# EAGLE design Grove - Air quality sensor v1.3 (EAGLE 6.4)

## Sheet 1 of 3
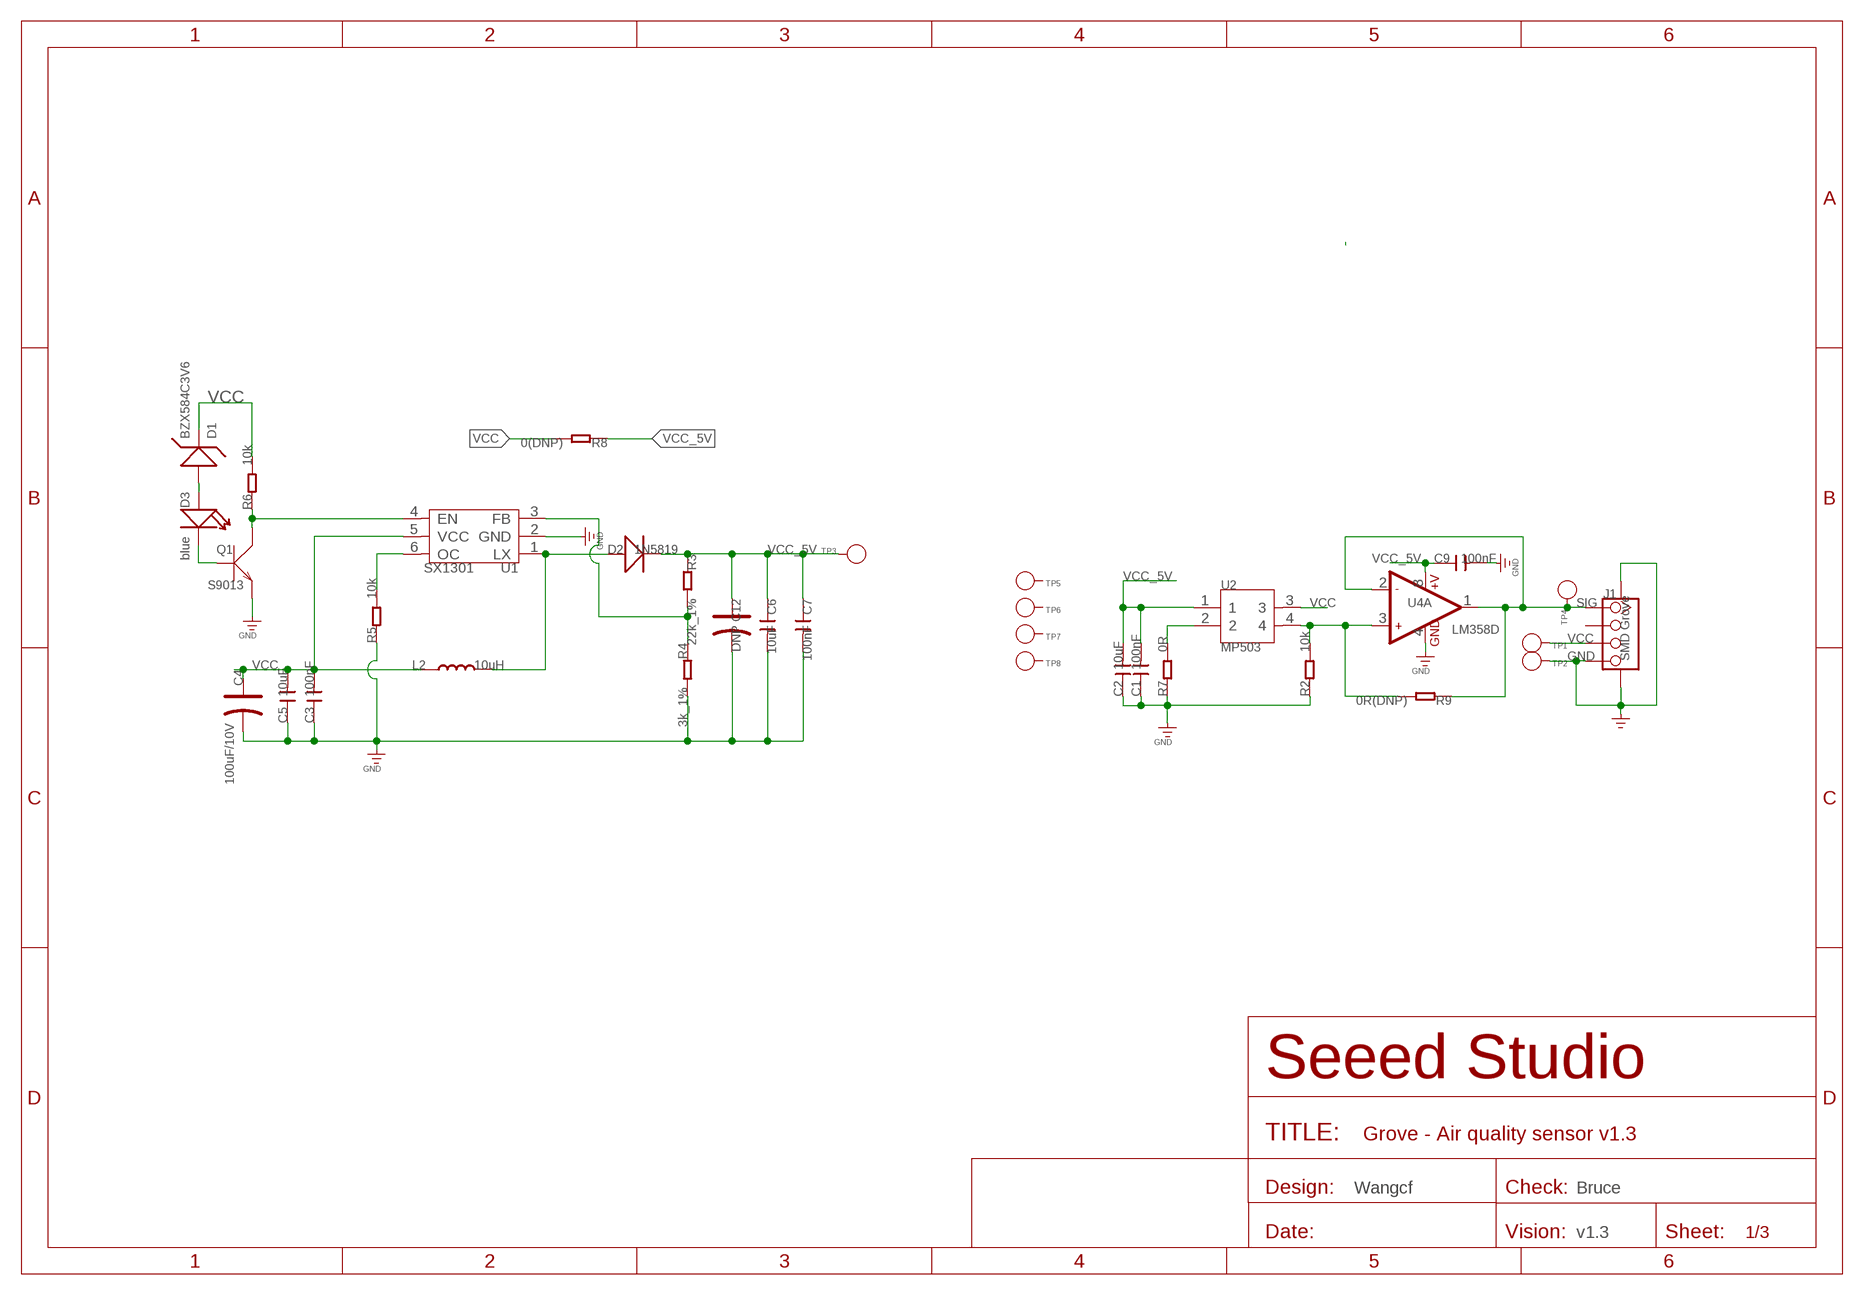
[diagram p0: schematic, sheet 1]

### Parts
C1  100nF  C-0603  [C0603]
C2  10uF  C-0805  [C0805]
C3  100nF  C-0603  [C0603]
C4  100uF/10V  CAP-AVX-B  [AVX-B]
C5  10uF  C-0805  [C0805]
C6  10uF  C-0805  [C0805]
C7  100nF  C-0603  [C0603]
C9  100nF  C-0603  [C0603]
C12  DNP  CAP-AVX-B  [AVX-B]
D1  BZX584C3V6  D-ZENER-2P'BZX584CX'  [SOD-523]
D2  1N5819  D'SMA'  [DO-214AC]
D3  blue  LED'0603'  [LED-0603]
J1  SMD Grove  TWIG-4P-2.0-SMD-FEMALE-REINFORCE'DD'  [4P-SMD-2.0]
L2  10uH  CD32'4R7'  [SD32-4R7MC]
Q1  S9013  TRANSISTOR-NPN-SOT23  [SOT-23]
R2  10k  R-0603  [R0603]
R3  22k_1%  R-0603  [R0603]
R4  3k_1%  R-0603  [R0603]
R5  10k  R-0603  [R0603]
R6  10k  R-0603  [R0603]
R7  0R  R-0603  [R0603]
R8  0(DNP)  R-0603  [R0603]
R9  0R(DNP)  R-0603  [R0603]
TP1  PAD-TEST-POINT'4545'  [TP_4545]
TP2  PAD-TEST-POINT'4545'  [TP_4545]
TP3  PAD-TEST-POINT'4545'  [TP_4545]
TP4  PAD-TEST-POINT'4545'  [TP_4545]
TP5  PAD-TEST-POINT'4545'  [TP_4545]
TP6  PAD-TEST-POINT'4545'  [TP_4545]
TP7  PAD-TEST-POINT'4545'  [TP_4545]
TP8  PAD-TEST-POINT'4545'  [TP_4545]
U1  SX1301  [SOT23-6L]
U2  MP503  SENSOR-MP503'V1.3'  [4P_3.1_9.4*9.4*17MM]
U4  LM358D  LMV358D  [SO08]

### Nets
EN: Q1.3(C) R6.1 U1.4(EN)
GND: C1.1 C2.1 C3.1 C4.- C5.1 C6.2 C7.2 C9.2 C12.- J1.4 J1.SS1 J1.SS2 Q1.2(E) R2.1 R4.2 R5.1 R7.1 TP2.T U1.2(GND) U4.4(A:GND)
N$1: R5.2 U1.6(OC)
N$2: D1.+ D3.+
N$3: D2.1(+) L2.2 U1.1(LX)
N$4: D3.- Q1.1(B)
N$5: R7.2 U2.2
N$6: R3.2 R4.1 U1.3(FB)
N$11: R2.2 R9.2 U2.4 U4.3(A:+IN1)
SIG: J1.1 R9.1 TP4.T U4.1(A:OUT1) U4.2(A:-IN1)
VCC: C3.2 C4.+ C5.2 D1.- J1.3 L2.1 R6.2 R8.2 TP1.T U1.5(VCC) U2.3
VCC_5V: C1.2 C2.2 C6.1 C7.1 C9.1 C12.+ D2.2(-) R3.1 R8.1 TP3.T U2.1 U4.8(A:+V)
Unconnected: J1.2 TP5.T TP6.T TP7.T TP8.T U4.5(B:+IN2) U4.6(B:-IN2) U4.7(B:OUT2)

### Notes on the sheet
- Wangcf | Bruce
- v1.3

## Sheet 2 of 3

## Sheet 3 of 3
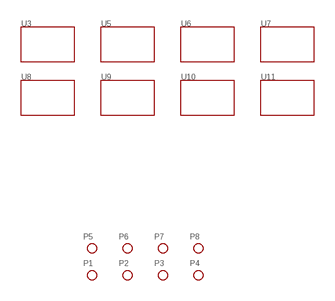
[diagram p1: schematic, sheet 3]

### Parts
P1  PAD-MARK  [ROUND-MARK-1.0]
P2  PAD-MARK  [ROUND-MARK-1.0]
P3  PAD-MARK  [ROUND-MARK-1.0]
P4  PAD-MARK  [ROUND-MARK-1.0]
P5  PAD-MARK  [ROUND-MARK-1.0]
P6  PAD-MARK  [ROUND-MARK-1.0]
P7  PAD-MARK  [ROUND-MARK-1.0]
P8  PAD-MARK  [ROUND-MARK-1.0]
U3  TWIG'2U'  [GROVE-TEST-PLATFORM]
U5  TWIG'2U'  [GROVE-TEST-PLATFORM]
U6  TWIG'2U'  [GROVE-TEST-PLATFORM]
U7  TWIG'2U'  [GROVE-TEST-PLATFORM]
U8  TWIG'2U'  [GROVE-TEST-PLATFORM]
U9  TWIG'2U'  [GROVE-TEST-PLATFORM]
U10  TWIG'2U'  [GROVE-TEST-PLATFORM]
U11  TWIG'2U'  [GROVE-TEST-PLATFORM]

## Library data of the parts
C1-C3 C5-C7 C9 = Discrete:C*: Ceramic Capacitors
C4 C12 = Discrete:CAP*: Electrolytic Capacitors,Tantalum Capacitors and Super Capacitors
D1 = Discrete-new:D-ZENER-2P: SOD-123:304030008;SOT-23:304030000
D2 = Discrete:D*
D3 = Discrete-new:LED
J1 = Connector :TWIG-4P-2.0-SMD-FEMALE-REINFORCE
L2 = template3:CD32: ferrite cored coil
P1-P8 = Discrete:PAD-MARK; PARTNO: DNP
Q1 = Discrete-new:TRANSISTOR-NPN*: NPN audion
R2-R9 = Discrete:R*
TP1-TP8 = Discrete:PAD-TEST-POINT; PARTNO: DNP
U1 = study:SX1301
U2 = template3:SENSOR-MP503: Air Purity Sensor
U3 U5-U11 = template:TWIG
U4 = IC:LMV358: General purpose LOW Voltage, Rail-to-Rail Output Amplifiers http://www.fairchildsemi.com/ds/LM/LMV358.pdf

## Board
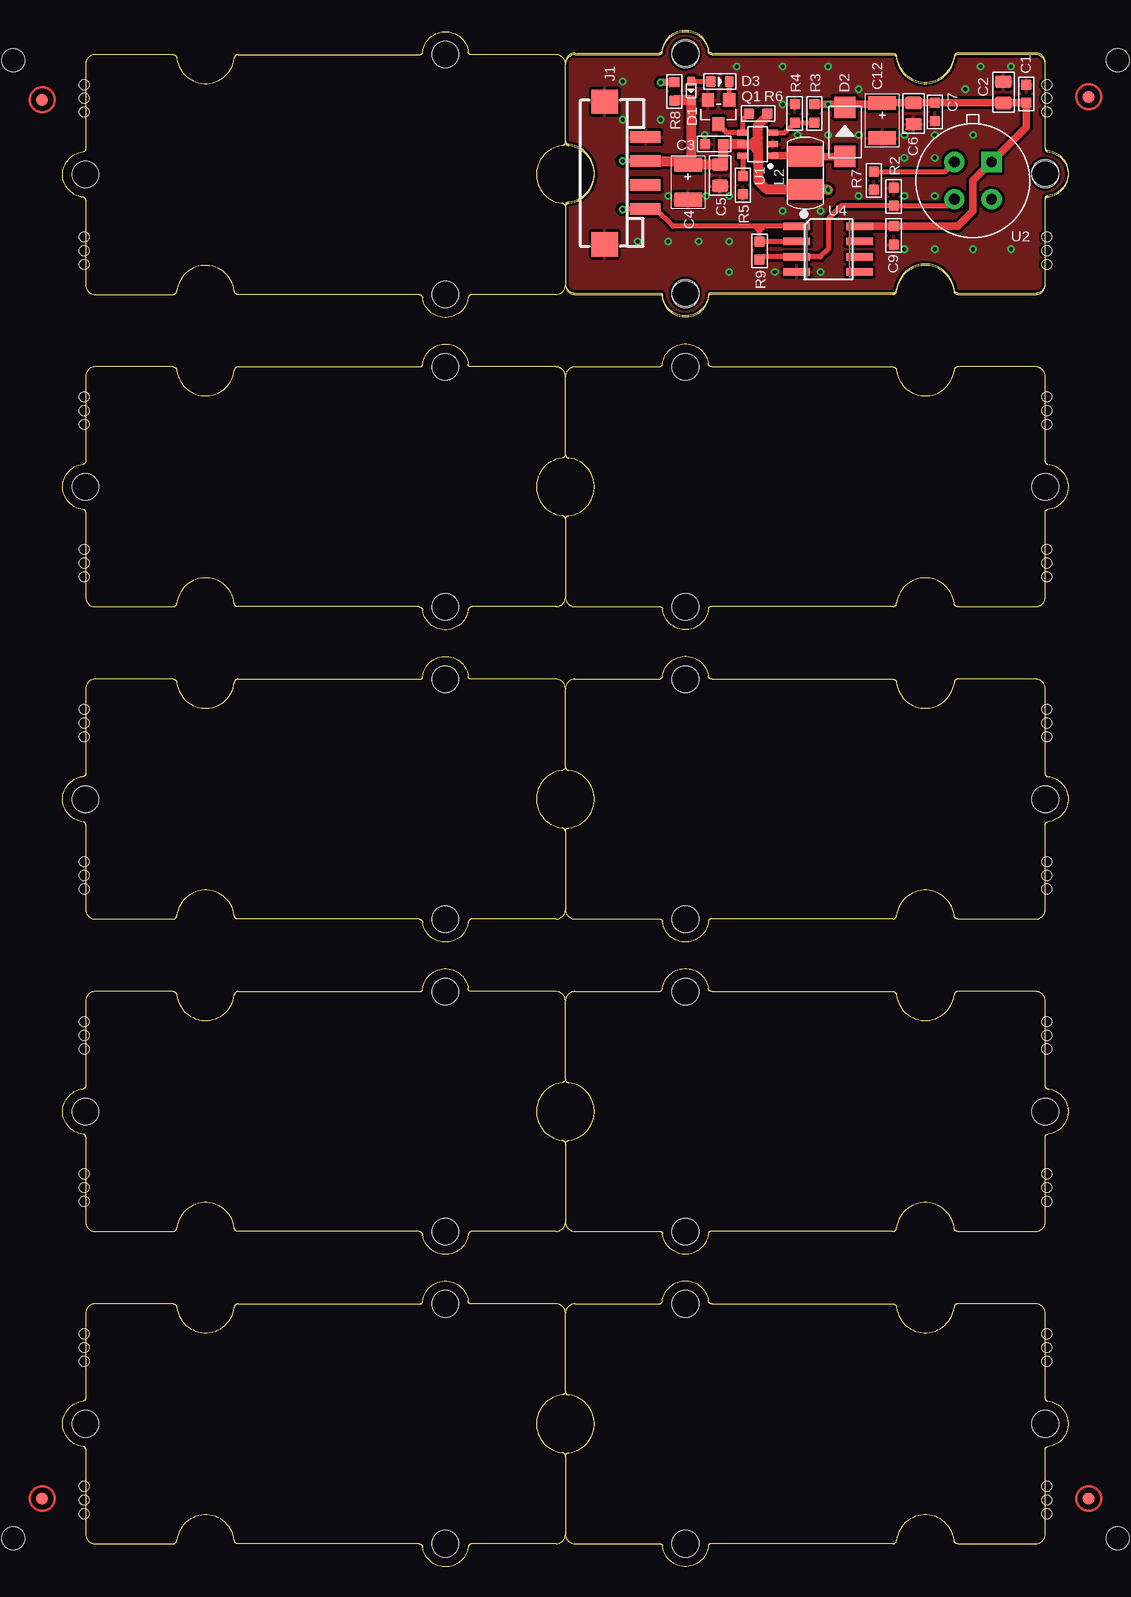
[diagram p2: board, top side]
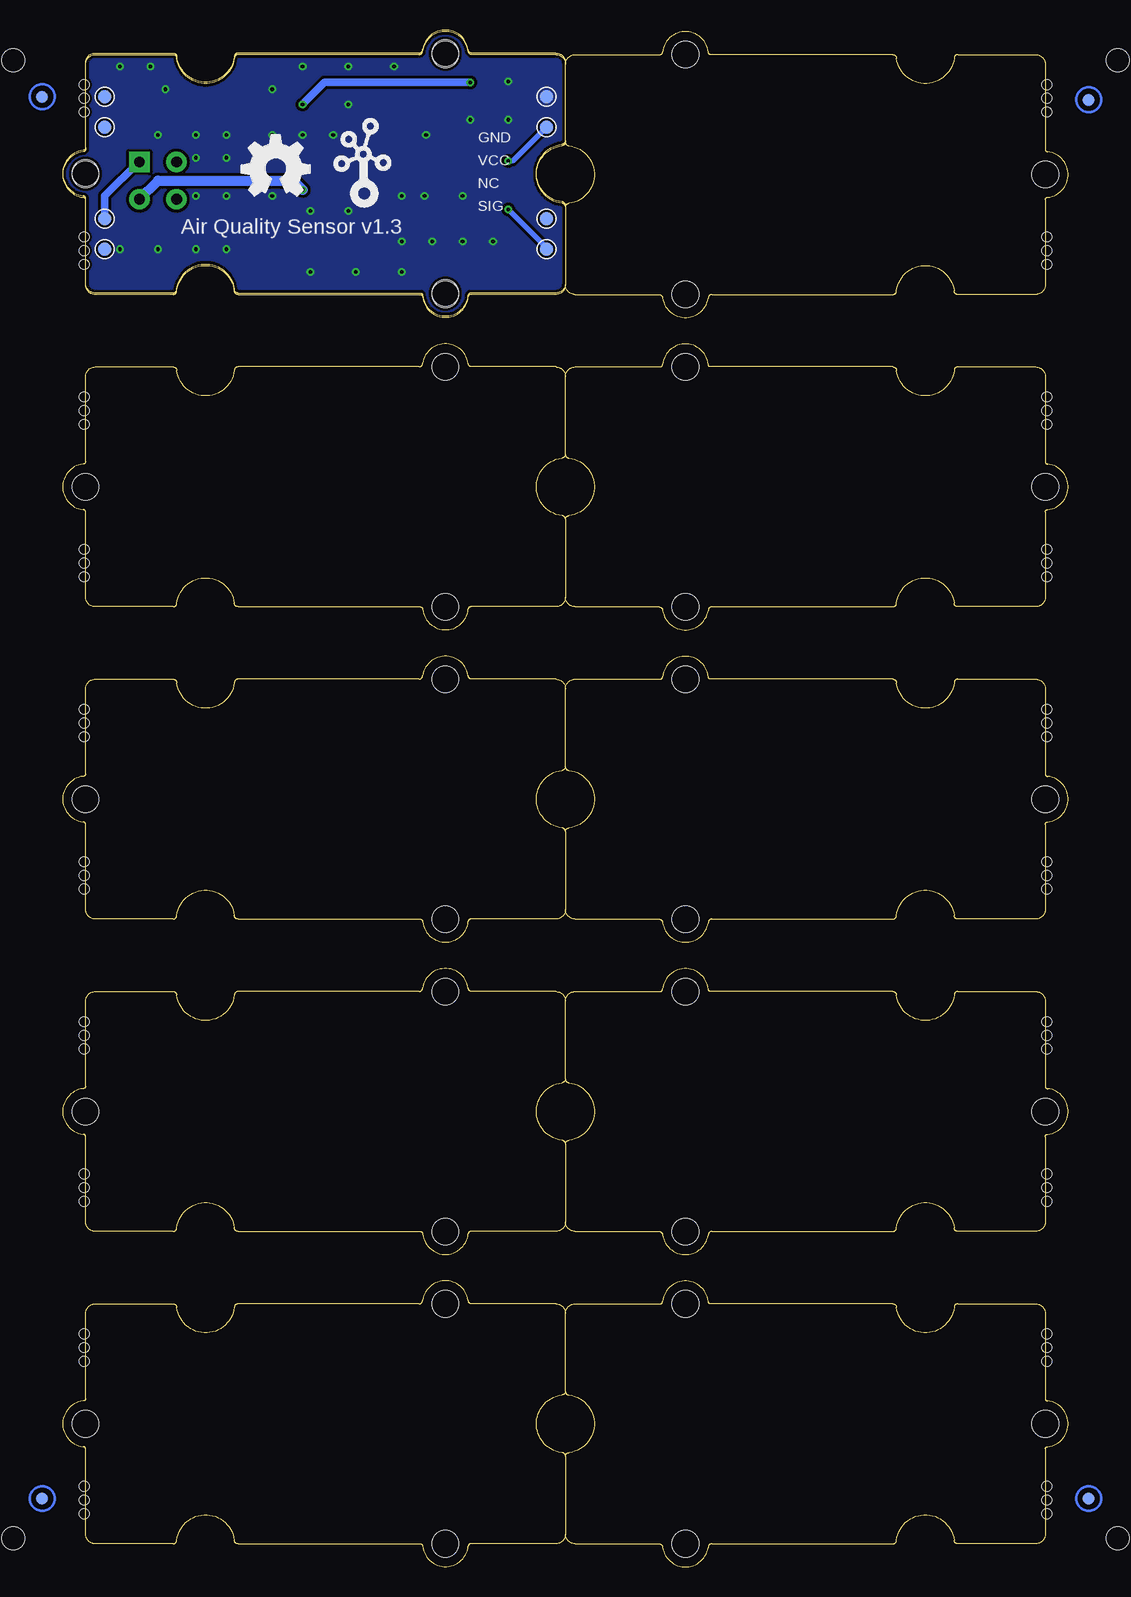
[diagram p3: board, bottom side, seen from below]

Size 83.82 x 128.11 mm. Coordinates in mm from the lower left corner, seen from the top.
Copper layers (1*16): Top 0.035mm / dielectric 1.5mm / Bottom 0.035mm
Design rules "SeeedStudio_2layer_DRU_no_angle_20140221 *": minimum track width 6mil, minimum drill 12mil, track to track 6mil, track to pad 6mil, pad to pad 6mil, via to via 6mil, smd to smd 0mil, copper to edge 10mil, drill to drill 10mil, minimum pad ring 10mil, minimum via ring 6mil, stop-mask expansion 2mil, vias tented up to drill 100mil, thermal gap 10mil
Holes 0.8 mm at 1.78,123.55 1.78,121.27 1.78,122.41 1.78,110.85 1.78,108.57 1.78,109.71 1.78,97.52 1.78,95.23 1.78,96.38 1.78,84.82 1.78,82.53 1.78,83.68 1.78,71.48 1.78,69.2 1.78,70.34 1.78,58.78 1.78,56.5 1.78,57.64 1.78,45.45 1.78,43.16 1.78,44.31 1.78,32.75 1.78,30.46 1.78,31.61 1.78,19.41 1.78,17.13 1.78,18.27 1.78,6.71 1.78,4.43 1.78,5.57 82.04,121.27 82.04,123.55 82.04,122.41 82.04,108.57 82.04,110.85 82.04,109.71 82.04,95.23 82.04,97.52 82.04,96.38 82.04,82.53 82.04,84.82 82.04,83.68 82.04,69.2 82.04,71.48 82.04,70.34 82.04,56.5 82.04,58.78 82.04,57.64 82.04,43.16 82.04,45.45 82.04,44.31 82.04,30.46 82.04,32.75 82.04,31.61 82.04,17.13 82.04,19.41 82.04,18.27 82.04,4.43 82.04,6.71 82.04,5.57
Holes 1.91 mm at -4.13,2.4 87.95,2.4 87.95,125.59 -4.13,125.59
tRestrict: area 58.7,115.9 to 63.4,116.4

### Footprints (pad centres in the part's own frame; a part is rotated, then mirrored left to right if it is on the bottom)
C0603 = smd 0.889 x 0.889: 1 -0.762,0; 2 0.762,0
C0805 = smd 1.016 x 1.397: 1 -0.889,0; 2 0.889,0
AVX-B = smd 1.143 x 2.286: + -1.46,0; - 1.46,0
SOD-523 = smd 0.762 x 0.7: + -0.8,0; - 0.8,0
DO-214AC = smd 1.8 x 1.77: 1 -2.042,0; 2 2.042,0
LED-0603 = smd 0.762 x 0.889: + -0.762,0; - 0.762,0
4P-SMD-2.0 = smd 0.965 x 2.54: 1 -3,0; 2 -1,0; 3 1,0; 4 3,0 | smd 2.032 x 2.184: SS1 -5.946,3.4; SS2 5.946,3.4
SD32-4R7MC = smd 1.75 x 3: 1 -1.375,0; 2 1.375,0
ROUND-MARK-1.0 = smd 1.016 x 1.016: P$1 0,0
SOT-23 = smd 1.016 x 1.143: 1 -0.889,-1.016; 2 0.889,-1.016; 3 0,1.016
R0603 = smd 0.889 x 0.889: 1 -0.762,0; 2 0.762,0
TP_4545 = smd 1.143 x 1.143: T 0,0
SOT23-6L = smd 0.5 x 0.9: 1 -0.961,-1.212; 2 -0.011,-1.212; 3 0.94,-1.212; 4 0.94,1.288; 5 -0.011,1.288; 6 -0.961,1.288
4P_3.1_9.4*9.4*17MM = drill 0.9 pad 1.7 square: 1 -1.55,-1.55 | drill 0.9 pad 1.7: 2 1.55,-1.55; 3 -1.55,1.55; 4 1.55,1.55
GROVE-TEST-PLATFORM = hole 2.2: -10,-10; -10,10; 20,0
SO08 = smd 0.61 x 2.21: 1 -1.905,-2.616; 2 -0.635,-2.616; 3 0.635,-2.616; 4 1.905,-2.616; 5 1.905,2.616; 6 0.635,2.616; 7 -0.635,2.616; 8 -1.905,2.616

### Placement (x,y rotation side)
C1  80.33,122.79 270 top
C2  78.42,122.92 270 top
C3  54.29,118.6 0 top
C4  52.13,115.43 270 top
C5  54.8,116 90 top
C6  70.93,121.14 270 top
C7  72.71,121.27 270 top
C9  69.28,110.98 270 top
C12  68.33,120.57 270 top
D1  52.39,123.05 270 top
D2  65.22,119.62 90 top
D3  54.8,123.81 0 top
J1  48.58,116.19 90 top
L2  61.91,116.19 90 top
P1  -1.71,5.7 0 top
P2  85.54,5.7 0 top
P3  -1.71,122.28 0 top
P4  85.54,122.54 0 top
P5  -1.71,5.7 0 bottom
P6  85.54,5.7 0 bottom
P7  85.54,122.54 0 bottom
P8  -1.71,122.28 0 bottom
Q1  54.67,121.27 180 top
R2  69.28,114.22 270 top
R3  62.68,121.14 270 top
R4  61.02,121.14 90 top
R5  56.71,115.17 90 top
R6  57.98,121.14 0 top
R7  67.63,115.55 90 top
R8  50.99,122.98 270 top
R9  58.1,109.71 270 top
TP1  43.5,120 0 bottom
TP2  43.5,122.54 0 bottom
TP3  80.33,112.38 0 bottom
TP4  43.5,109.84 0 bottom
TP5  80.33,109.84 0 bottom
TP6  80.33,120 0 bottom
TP7  43.5,112.38 0 bottom
TP8  80.33,122.54 0 bottom
U1  57.98,118.6 90 top
U2  75.88,115.55 180 top
U3  61.91,37.96 0 top
U4  63.82,109.84 270 top
U5  21.91,37.96 180 top
U6  61.91,63.99 0 top
U7  21.91,63.99 180 top
U8  61.91,90.03 0 top
U9  21.91,90.03 180 top
U10  21.91,116.06 180 top
U11  61.91,116.06 0 top
U12  [GROVE-TEST-PLATFORM]  61.91,11.92 0 top
U13  [GROVE-TEST-PLATFORM]  21.91,11.92 180 top
U$6  [GROVE-TEST-PLATFORM]  61.91,116.19 0 top
U$7  [OSHW_FILLX200_NOTEXT]  68.9,114.28 0 bottom
U$8  [TWIGLOGO]  58.74,114.28 0 bottom

### Tracks (layer width: path | path; a pad name or v marks a point on that pad's centre or on a via)
EN
  Top 0.406: R6.1 56.69,120.62 U1.4 55.39,119.54 Q1.3
GND  (via drill 0.3 pad 0.64)
  other vias: 60.01,125.08 75.25,123.17 72.71,119.36 75.88,119.36 70.17,119.36 72.71,114.28 66.36,114.28 70.17,109.84 63.18,107.93 59.37,107.93 55.56,107.93 55.56,110.47 53.02,110.47 50.48,110.47 47.94,110.47 50.48,114.28 53.66,114.28 55.56,114.28 53.53,119.36 60.01,121.9 49.85,120.63 46.67,120.63 46.67,123.81 70.17,117.46 72.71,117.46 70.17,114.28 72.71,109.84 79.06,109.84 75.88,109.84 66.36,119.36 61.28,119.36 60.01,113.01 63.82,119.36 63.18,113.01 66.36,123.17 63.82,125.08 56.2,125.08 79.06,125.08 76.52,125.08
  pour Top (isolate 0.254): 41.59,128.25 84.14,128.25 84.14,104.12 41.59,104.12
  pour Bottom (isolate 0.254): 41.59,128.25 84.14,128.25 84.14,104.12 41.59,104.12
N$1
  Top 0.406: U1.6 56.69,115.95 R5.2
N$2
  Top 0.406: 52.43,123.81 D1.+ 52.39,123.81 D3.+
N$3
  Top 0.61: U1.1 61.84,117.64 L2.2 65.2,117.56 D2.1
N$4
  Top 0.406: Q1.1 D3.-
N$5
  Top 0.406: R7.2 73.55,116.32 U2.2
N$6
  Top 0.406: U1.3 60.19,119.54 R4.1 R3.2
N$11
  Top 0.406: R9.2 58.36,109.2 U4.3 63.18,109.2 63.82,109.84 63.82,112.38 64.9,113.46 R2.2 73.79,113.46 U2.4
SIG  (via drill 0.3 pad 0.64)
  Top 0.406: v46.67,113.14 46.72,113.19 J1.1 48.66,113.27 49.34,113.27 50.86,111.74 57.72,111.74 | U4.1 58.48,111.74 | 58.48,111.74 58.1,111.74 | 58.1,111.74 57.72,111.74 | U4.2 R9.1 58.1,111.36 | 58.1,111.36 58.1,111.74 | 57.72,111.74 58.1,111.36 | 58.1,111.36 58.48,111.74
  Bottom 0.406: TP4.T 43.5,109.97 v46.67,113.14
VCC  (via drill 0.3 pad 0.64)
  Top 0.406: J1.3 46.69,117.19 v46.67,117.2
  Top 0.813: 57.46,118.59 U1.5 55.07,118.59 C3.2 55.06,116.95 54.87,116.95 C5.2 52.64,116.89 | 57.48,118.59 57.97,118.59 57.98,118.6 | 57.98,118.09 57.98,115.55 58.72,114.81 L2.1 61.94,114.79 v63.82,114.79 | 57.98,118.6 57.98,119.11 | 57.98,119.11 57.98,120.19 58.74,120.95 R6.2 | 57.46,118.59 57.98,119.11 | 57.46,118.59 57.48,118.59 | 57.48,118.59 57.98,118.09 | 57.98,118.09 57.98,118.6 | 52.64,116.89 52.39,116.89 | 52.39,116.89 C4.+ 52.39,117.14 | J1.3 52.53,117.19 52.64,117.08 52.64,116.89 | 52.39,116.89 D1.- 51.02,122.25 R8.2
  Bottom 0.406: v46.67,117.2 46.29,117.2 TP1.T
  Bottom 0.813: U2.3 75.88,115.55 64.58,115.55 v63.82,114.79
VCC_5V  (via drill 0.3 pad 0.64)
  Top 0.61: U4.8 C9.1 74.61,111.74 75.88,113.01 75.88,115.55 U2.1 77.73,117.39 77.79,117.46 80.33,120 C1.2 C2.2 C7.1 C6.1 C12.+ 68.2,121.9 64.97,121.9 | R3.1 v63.82,121.9 64.97,121.9 | 64.97,121.9 D2.2 | R8.1 v49.85,123.74
  Bottom 0.61: TP3.T 80.33,114.28 77.51,117.1 U2.1 | v49.85,123.74 61.98,123.74 v63.82,121.9

### Text on the board
bPlace: GND | VCC | NC | SIG | Air Quality Sensor v1.3